# Altium schematic sheet Power_stage.SchDoc
size A4; SheetNumber: 5; SheetTotal: 5
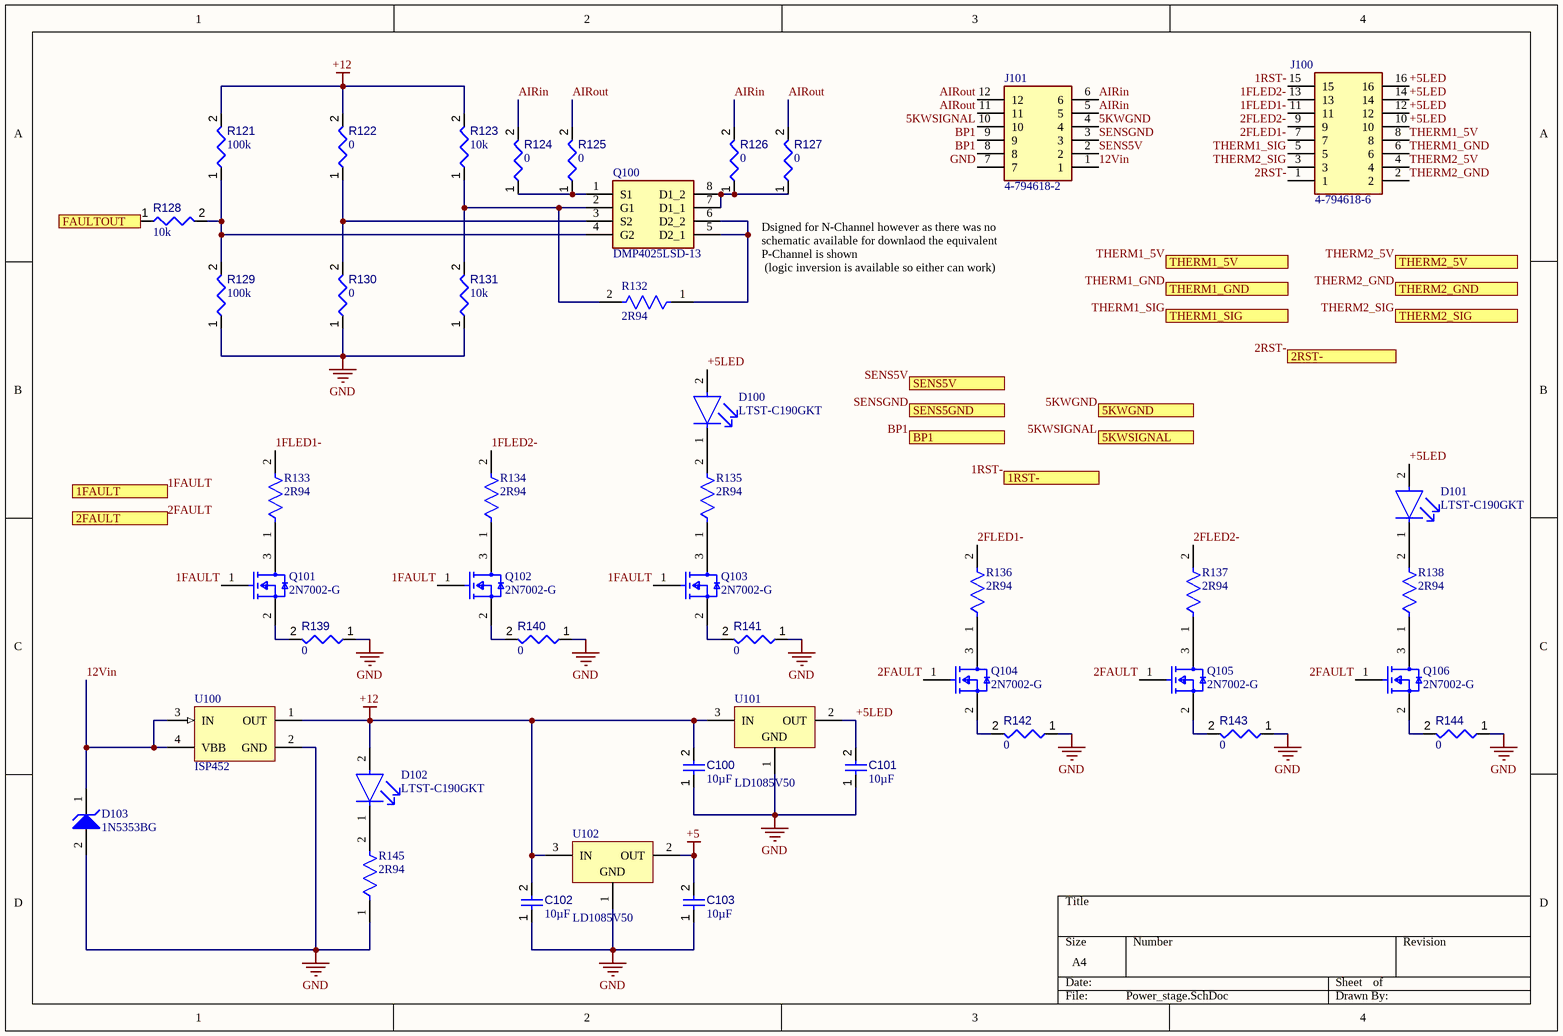
[diagram p0: Power_stage.SchDoc]

## Parts
C100  value 10µF  [CAPC0805(2012)145_L]  (hidden comment: Capacitor 10µF +/-20% 25V 0805)
C101  value 10µF  [CAPC0805(2012)145_L]  (hidden comment: Capacitor 10µF +/-20% 25V 0805)
C102  value 10µF  [CAPC0805(2012)145_L]  (hidden comment: Capacitor 10µF +/-20% 25V 0805)
C103  value 10µF  [CAPC0805(2012)145_L]  (hidden comment: Capacitor 10µF +/-20% 25V 0805)
D100  LTST-C190GKT  [FP-LTST-C190GKT-MFG]
D101  LTST-C190GKT  [FP-LTST-C190GKT-MFG]
D102  LTST-C190GKT  [FP-LTST-C190GKT-MFG]
D103  1N5353BG  [ONSC-SURMETIC40-2-017AA-01]
J100  4-794618-6  [47946186]
J101  4-794618-2  [47946182]
Q100  DMP4025LSD-13  [SOIC127P600X175-8N]
Q101  2N7002-G  [FP-2N7002-G-IPC_C]
Q102  2N7002-G  [FP-2N7002-G-IPC_C]
Q103  2N7002-G  [FP-2N7002-G-IPC_C]
Q104  2N7002-G  [FP-2N7002-G-IPC_C]
Q105  2N7002-G  [FP-2N7002-G-IPC_C]
Q106  2N7002-G  [FP-2N7002-G-IPC_C]
R121  value 100k  [RESC1608X55X25ML10T15]  (hidden comment: Resistor 100k +/-1% 0603 100 mW)
R122  value 0  [RESC0603(1608)_L]  (hidden comment: 0R3J)
R123  value 10k  [RESC1608X55X25ML10T15]  (hidden comment: Resistor 10k +/-1% 0603 100 mW)
R124  value 0  [RESC0603(1608)_L]  (hidden comment: 0R3J)
R125  value 0  [RESC0603(1608)_L]  (hidden comment: 0R3J)
R126  value 0  [RESC0603(1608)_L]  (hidden comment: 0R3J)
R127  value 0  [RESC0603(1608)_L]  (hidden comment: 0R3J)
R128  value 10k  [RESC1608X55X25ML10T15]  (hidden comment: Resistor 10k +/-1% 0603 100 mW)
R129  value 100k  [RESC1608X55X25ML10T15]  (hidden comment: Resistor 100k +/-1% 0603 100 mW)
R130  value 0  [RESC0603(1608)_L]  (hidden comment: 0R3J)
R131  value 10k  [RESC1608X55X25ML10T15]  (hidden comment: Resistor 10k +/-1% 0603 100 mW)
R132  2R94  [FP-CPF0603-MFG]
R133  2R94  [FP-CPF0603-MFG]
R134  2R94  [FP-CPF0603-MFG]
R135  2R94  [FP-CPF0603-MFG]
R136  2R94  [FP-CPF0603-MFG]
R137  2R94  [FP-CPF0603-MFG]
R138  2R94  [FP-CPF0603-MFG]
R139  value 0  [RESC0603(1608)_L]  (hidden comment: 0R3J)
R140  value 0  [RESC0603(1608)_L]  (hidden comment: 0R3J)
R141  value 0  [RESC0603(1608)_L]  (hidden comment: 0R3J)
R142  value 0  [RESC0603(1608)_L]  (hidden comment: 0R3J)
R143  value 0  [RESC0603(1608)_L]  (hidden comment: 0R3J)
R144  value 0  [RESC0603(1608)_L]  (hidden comment: 0R3J)
R145  2R94  [FP-CPF0603-MFG]
U100  ISP452  [INF-SOT223_L]
U101  LD1085V50  [TO220]
U102  LD1085V50  [TO220]

## Ports
1FAULT, 1RST-, 2FAULT, 2RST-, 5KWGND, 5KWSIGNAL, BP1, FAULTOUT, SENS5GND, SENS5V, THERM1_5V, THERM1_GND, THERM1_SIG, THERM2_5V, THERM2_GND, THERM2_SIG

## Nets
+5: C103.2 U102.2(OUT)
+12: C100.2 C102.2 D102.2(A) R121.2 R122.2 R123.2 U100.1(OUT) U101.3(IN) U102.3(IN)
GND: C100.1 C101.1 C102.1 C103.1 D103.2(A) J101.7 R129.1 R130.1 R131.1 R139.1 R140.1 R141.1 R142.1 R143.1 R144.1 R145.1 U100.2(GND) U101.1(GND) U102.1(GND)
1FAULT: Q101.1(GATE) Q102.1(GATE) Q103.1(GATE) ; port 1FAULT
1FLED1-: J100.11 R133.2
1FLED2-: J100.13 R134.2
1RST-: J100.15 ; port 1RST-
2FAULT: Q104.1(GATE) Q105.1(GATE) Q106.1(GATE) ; port 2FAULT
2FLED1-: J100.7 R136.2
2FLED2-: J100.9 R137.2
2RST-: J100.1 ; port 2RST-
5KWGND: J101.4 ; port 5KWGND
5KWSIGNAL: J101.10 ; port 5KWSIGNAL
12Vin: D103.1(K) J101.1 U100.3(IN) U100.4(VBB)
+5LED: C101.2 D100.2(A) D101.2(A) J100.10 J100.12 J100.14 J100.16 U101.2(OUT)
AIRin: J101.5 J101.6 R124.2 R126.2
AIRout: J101.11 J101.12 R125.2 R127.2
BP1: J101.8 J101.9 ; port BP1
FAULTOUT: R128.1 ; port FAULTOUT
SENS5V: J101.2 ; port SENS5V
SENSGND: J101.3 ; port SENS5GND
THERM1_5V: J100.8 ; port THERM1_5V
THERM1_GND: J100.6 ; port THERM1_GND
THERM1_SIG: J100.5 ; port THERM1_SIG
THERM2_5V: J100.4 ; port THERM2_5V
THERM2_GND: J100.2 ; port THERM2_GND
THERM2_SIG: J100.3 ; port THERM2_SIG
NetD100_1: D100.1(C) R135.2
NetD101_1: D101.1(C) R138.2
NetD102_1: D102.1(C) R145.2
NetQ100_1: Q100.1(S1) R124.1 R125.1
NetQ100_2: Q100.2(G1) R123.1 R131.2 R132.2
NetQ100_3: Q100.3(S2) R122.1 R130.2
NetQ100_4: Q100.4(G2) R121.1 R128.2 R129.2
NetQ100_5: Q100.5(D2_1) Q100.6(D2_2) R132.1
NetQ100_7: Q100.7(D1_1) Q100.8(D1_2) R126.1 R127.1
NetQ101_2: Q101.2(SOURCE) R139.2
NetQ101_3: Q101.3(DRAIN) R133.1
NetQ102_2: Q102.2(SOURCE) R140.2
NetQ102_3: Q102.3(DRAIN) R134.1
NetQ103_2: Q103.2(SOURCE) R141.2
NetQ103_3: Q103.3(DRAIN) R135.1
NetQ104_2: Q104.2(SOURCE) R142.2
NetQ104_3: Q104.3(DRAIN) R136.1
NetQ105_2: Q105.2(SOURCE) R143.2
NetQ105_3: Q105.3(DRAIN) R137.1
NetQ106_2: Q106.2(SOURCE) R144.2
NetQ106_3: Q106.3(DRAIN) R138.1

## Notes on the sheet
- Dsigned for N-Channel however as there was no schematic available for downlaod the equivalent P-Channel is shown
  (logic inversion is available so either can work)

## Library data of the parts
C100-C103 = CMP-001-00079-4: Chip Capacitor, 10µF +/-20%, 25V, 0805, Thickness 1.45 mm; Tolerance: 10%; Max Operating Temperature: 85°C; Case/Package: 0805; Voltage Rating: 25V; Min Operating Temperature: -55°C; Mounting Technology: SMT; Pins: 2
D100-D102 = CMP-22017-000005-2: LED GREEN CLEAR CHIP SMD; Dominant Wavelength: 569nm; Reverse Voltage: 5V; Lens Color: Colorless; Viewing Angle: 130°; Voltage: 2V; Forward Current: 30mA; Power Dissipation: 100mW; Luminous Intensity: 6mcd; Number of LEDs: 1; Forward Voltage: 2.1V; Wavelength: 565nm; Test Current: 10mA; Min Operating Temperature: -55°C; Lens Style: Clear; Mount: Surface Mount; Width: 0.8mm; Packaging: Tape and Reel; Lens Transparency: Clear; Case Code (Metric): 1608; Depth: 0.8mm; Case Code (Imperial): 0603; Case/Package: 0603; Number of Pins: 2; Max Operating Temperature: 85°C; Lead Free: Lead Free; Number of Elements: 1; Length: 1.6mm; Height: 0.8mm; Package Quantity: 1; Power Rating: 100mW; Radiation Hardening: No; Illumination Color: Green; Color: Green
D103 = CMP-1060-01290-1: 5 W Zener Voltage Regulator, 2-Pin Surmetic(TM) 40, Pb-Free, Bulk Box; Manufacturer: On Semiconductor; P Max (W): 5; VZ Typ (V): 16; Packing: Bulk Box; RoHS: Pb-Free; DatasheetVersion: Rev. 14; PackageDescription: 2-Pin, Axial Lead, Diameter 3.49 mm; ComponentLink3Description: Package Specification; PackageVersion: Rev. O, 09/2005; Mounting Technology: Through Hole; ComponentLink2Description: Datasheet; PartNumber: 1N5353BG; PackageReference: SURMETIC40-2-017AA-01; ComponentLink2URL: http://www.onsemi.cn/pub_link/Collateral/1N5333B-D.PDF; ComponentLink3URL: http://www.onsemi.cn/pub_link/Collateral/017AA.PDF; ComponentLink1Description: Manufacturer URL; ComponentLink1URL: http://www.onsemi.com/
J100 = 4-794618-6: Connector; Manufacturer_Name: TE Connectivity; Datasheet Link: https://www.te.com/commerce/DocumentDelivery/DDEController?Action=showdoc&DocId=Customer+Drawing%7F794618%7FF4%7Fpdf%7FEnglish%7FENG_CD_794618_F4.pdf%7F4-794618-6; Height: 8.8mm; Manufacturer_Part_Number: 4-794618-6; Mouser Part Number: 571-4-794618-6; Mouser Price/Stock: https://www.mouser.co.uk/ProductDetail/TE-Connectivity-AMP/4-794618-6?qs=aUp63snYJwBR7PjA8Kx36Q%3D%3D
J101 = 4-794618-2: Connector; Manufacturer_Name: TE Connectivity; Datasheet Link: https://componentsearchengine.com/Datasheets/2/4-794618-2.pdf; Height: 8.67mm; Manufacturer_Part_Number: 4-794618-2; Mouser Part Number: 571-4-794618-2; Mouser Price/Stock: https://www.mouser.co.uk/ProductDetail/TE-Connectivity-AMP/4-794618-2?qs=So72BguRTJaXDhFpFUBejg%3D%3D; Arrow Part Number: 4-794618-2; Arrow Price/Stock: https://www.arrow.com/en/products/4-794618-2/te-connectivity
Q100 = DMP4025LSD-13: MOSFET (P-Channel); Manufacturer_Name: Diodes Inc.; Datasheet Link: https://ms.componentsearchengine.com/Datasheets/2/DMP4025LSD-13.pdf; Height: 1.75mm; Manufacturer_Part_Number: DMP4025LSD-13; Mouser Part Number: 621-DMP4025LSD-13; Mouser Price/Stock: https://www.mouser.co.uk/ProductDetail/Diodes-Incorporated/DMP4025LSD-13?qs=gfe7vQ8txpWs%252BZpALpt3%252Bg%3D%3D; Arrow Part Number: DMP4025LSD-13; Arrow Price/Stock: https://www.arrow.com/en/products/dmp4025lsd-13/diodes-incorporated
Q101-Q106 = CMP-06369-000003-1: MOSFET N-CH 60V 0.115A SOT23-3; Manufacturer: Microchip; Standoff Height: 0.01mm; Rthja Max: 203°C/W; Continuous Drain Current: 115mA; Depletion Mode: False; Typ Forward Diode Voltage: 1.2V; Number Of Channels: 1; Power Dissipation: 0.36W; Turn Off Delay Time: 20ns; Threshold Vgs Min: 1V; Threshold Vgs Max: 2.5V; Drain To Source Resistance: 7.5Ω; Input Capacitace At Vds: 50pF @ 25V; Reverse Recovery Time: 400ns; Pulse Drain Current: 800mA; Gate To Source Voltage: 30V; Manufacturer Part Number: 2N7002-G; Ambient Temperature Range Low: -55°C; Temperature Range Low: -55°C; ComponentLink2Description: Datasheet; Automotive: No; Temperature Range High: +150°C; Temperature: -55°C to +150°C; Ambient Temperature Range High: +150°C; ComponentLink2URL: http://ww1.microchip.com/downloads/en/DeviceDoc/2N7002-N-Channel-Enhancement-Mode-Vertical-DMOS-FET-Data-Sheet-20005797A.pdf; Octopart: https://octopart.com/2n7002-g-microchip-47153309; Mouser Description: Mosfet; N-channel Enhancement Mode; 60V; 7.5 OHM3 SOT-23T/R; Lead Free: Yes; Number Of N Channels: 1; Turn On Delay Time: 20ns; RoHS: TRUE; Digikey Description: MOSFET N-CH 60V 0.115A SOT23-3; Category: Trans; Ipc Land Pattern Name: SOT95P237X100-3; Height: 1.12mm; Device Class L2: Transistors; Drain To Source Breakdown Voltage: 60V; Device Class L1: Discrete Semiconductors; Drain To Source Voltage: 60V; Device Class L3: MOSFETs; Package: 2N7002-G
R121 R129 = CMP-009-00023-5: Chip Resistor, 100 KOhm, +/- 1%, 0.1 W, -55 to 155 degC, 0603 (1608 Metric); Voltage Rating: 50V; Power: 100mW; Max Operating Temperature: 155°C; RoHS Compliant: True; Tolerance: 1%; Pins: 2; Case/Package: 0603; Mounting Technology: SM; Min Operating Temperature: -55°C
R122 R124-R127 R130 R139-R144 = CMP-009-00063-2: Jumper 0603 (1608 Metric); Case/Package: 0603; Mounting Technology: SMT; Pins: 2
R123 R128 R131 = CMP-009-00017-5: Chip Resistor, 10 KOhm, +/- 1%, 01 W, -55 to 155 degC, 0603 (1608 Metric); Voltage Rating: 50V; Power: 100mW; RoHS Compliant: True; Min Operating Temperature: -55°C; Pins: 2; Case/Package: 0603; Mounting Technology: SM; Max Operating Temperature: 155°C; Tolerance: 1%
R132-R138 R145 = CMP-03211-006952-1: RES SMD 2.94Ω 1% 1/16W 0603; Manufacturer Part Number: CPF0603F2R94C1; Manufacturer: TE Connectivity; Power Rating: 0.063W; Voltage Rating: 50V; Temperature Coefficient: 50ppm/°C; ComponentLink2URL: https://www.te.com/commerce/DocumentDelivery/DDEController?Action=showdoc&DocId=Data+Sheet%7F1773200%7FM%7Fpdf%7FEnglish%7FENG_DS_1773200_M.pdf%7F3-1676481-2; Ipc Land Pattern Name: RESC15580X45; ComponentLink2Description: Datasheet; Package: CPF0603; Automotive: No; Value: 2.94Ω; Temperature Range Low: -55°C; RoHS: TRUE; Resistance: 2.94Ω; Height: 0.55mm; Lead Free: Yes; Device Class L3: Chip SMD Resistors; Series: CPF; octopart_url: https://octopart.com/cpf0603f2r94c1-te+connectivity-7515214; Tolerance: 1%; Composition: Thin Film; Temperature Range High: +155°C; Device Class L1: Passive Components; Octopart: https://octopart.com/cpf0603f2r94c1-te+connectivity-7515214; Temperature: -55°C to +155°C; Category: Res; Device Class L2: Resistors; packaging: 1k Reel
U100 = CMP-1095-00141-1: Smart Power High-Side-Switch for Industrial Applications, 5 to 34 V Operating, -30 to 85 degC, SOT223, Reel, Green; Manufacturer: Infineon; Green: TRUE; IL (nom)min - all channels active: 0.7Â A; Channels: 1; IL (nom)min - one channel active: 0.8Â A; Operating Voltage Range (min): 5 V; Ptot (max): 1.8Â W; toff (max): 150 us; RON (max) @ Tj max: 400 mOhm; ton (max): 100 us; IL (SCp): 1.5Â A; Operating Voltage Range (max): 34 V; RON @ 25 degC: 200 mOhm (max); ComponentLink3Description: Package Specification; Mounting Technology: Surface Mount; ComponentLink2Description: Datasheet; PartNumber: ISP452; Packing: Reel; Load Current (typ): 0.7Â A; PackageDescription: 4-Pin Small Outline Transistor Package, 6.5 x 3.5 mm Body, 2.3 mm Pitch; ComponentLink3URL: http://www.infineon.com/dgdl/SOT223-Package_Overview.pdf?folderId=db3a30431936bc4b0119530470b03c3d&fileId=db3a30431936bc4b0119531d40b93c5c; ComponentLink1Description: Manufacturer URL; ComponentLink1URL: http://www.infineon.com/; ComponentLink2URL: http://www.infineon.com/dgdl/ISP452_20060301.pdf?folderId=db3a304412b407950112b408e8c90004&fileId=db3a304412b407950112b42957ef40c3; PackageReference: SOT223; IL (SC): 1.5Â A; PackageVersion: Apr-08
U101 U102 = CMP-0244-00494-1: 3A, Low Drop Positive Voltage Regulator, 5V, 3-Pin TO-220; ComponentLink1URL: http://www.st.com; PackageDescription: TO, Thru-Hole, Vertical, Heatsink Mounted; 3 In-Line Leads; Pitch 2.54 mm; DatasheetVersion: 28/07/2009; PackageVersion: ver3.0; ComponentLink2URL: http://www.st.com/internet/com/TECHNICAL_RESOURCES/TECHNICAL_LITERATURE/DATASHEET/CD00001883.pdf; ComponentLink1Description: Manufacturer URL; PackageReference: TO220; ComponentLink2Description: Datasheet; ComponentLink3URL: http://www.st.com/internet/com/TECHNICAL_RESOURCES/TECHNICAL_LITERATURE/PACKAGE_INFORMATION/CD00004649.pdf; ComponentLink3Description: Package Specification